# EAGLE schematic E73-2G4M04S1B_eink (EAGLE 6.1)

## Sheet 1 of 2
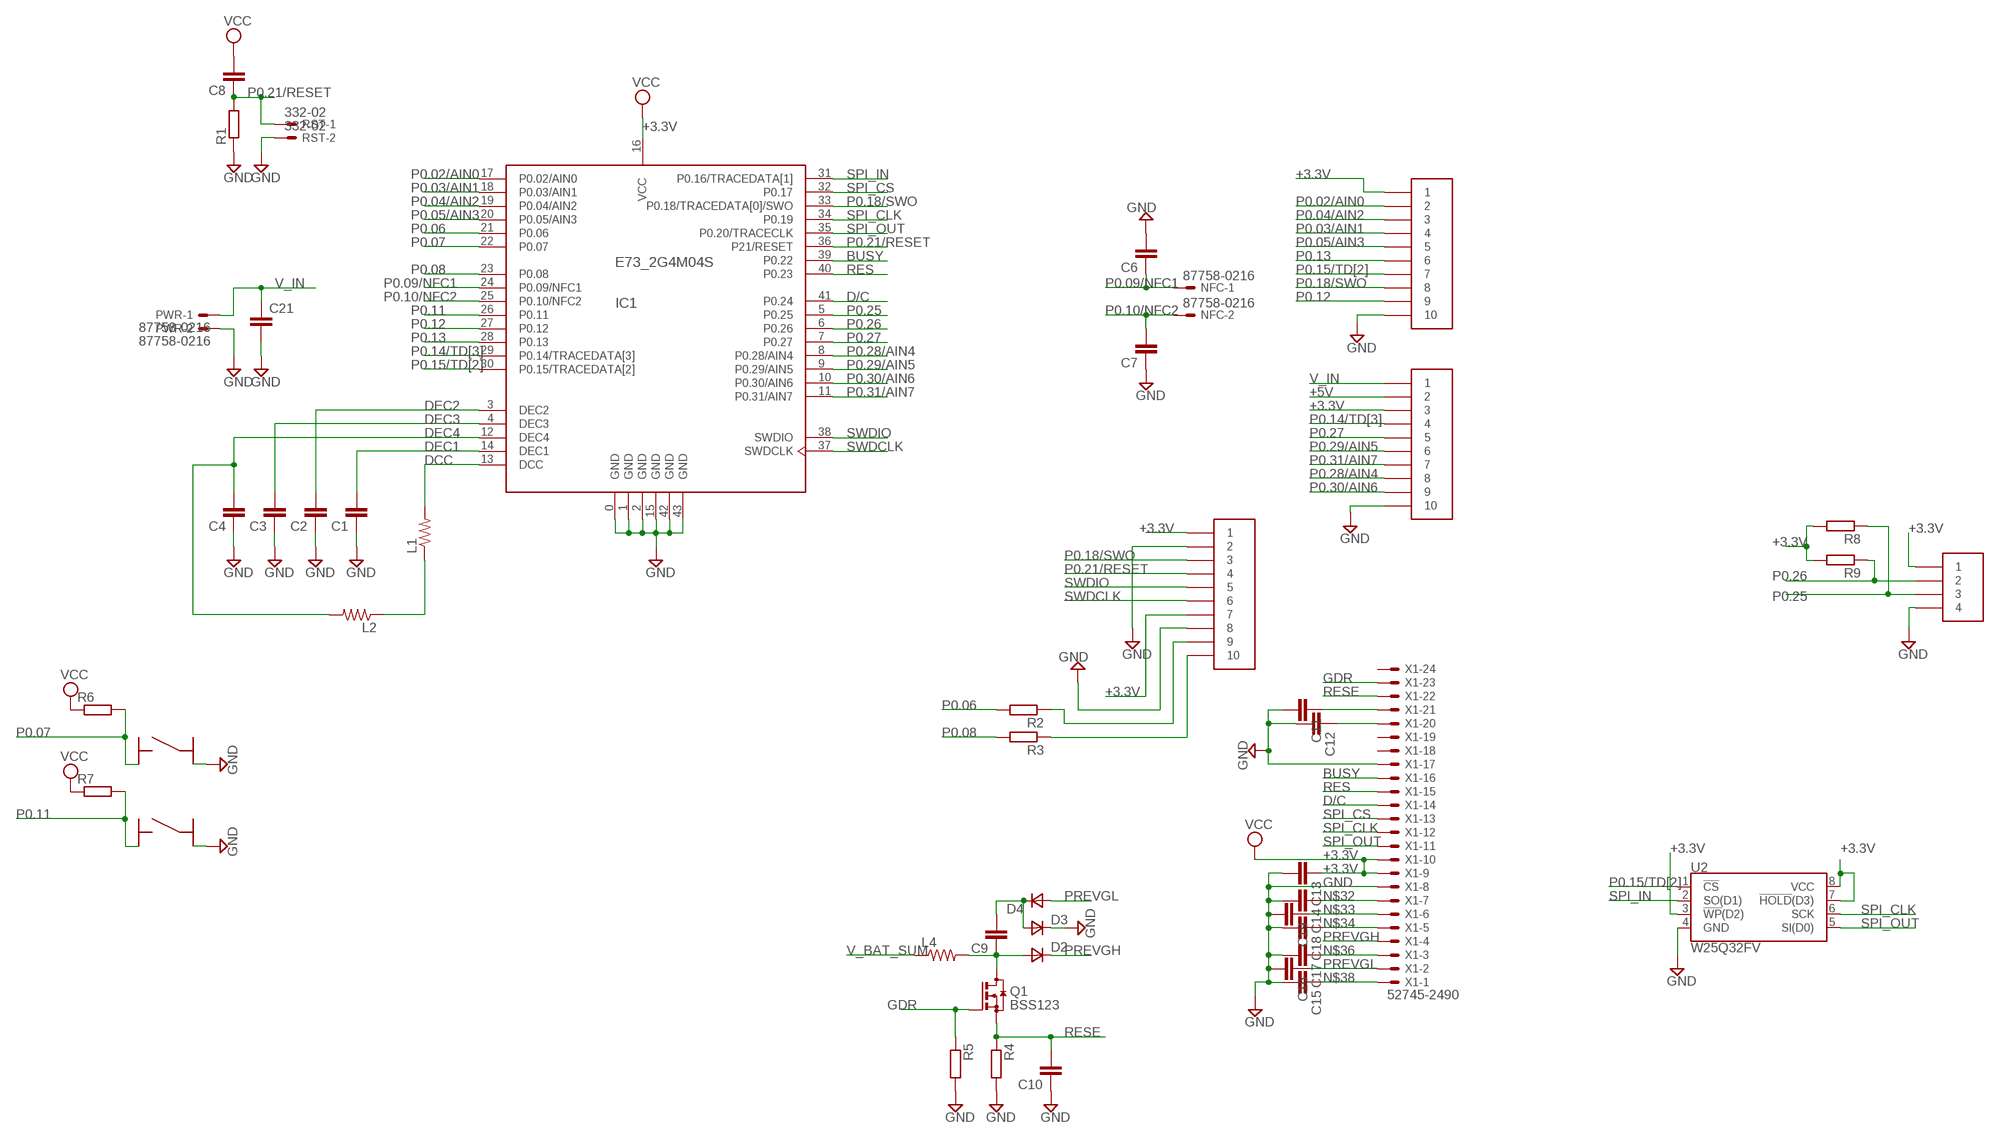
[diagram p0: schematic, sheet 1]

### Parts
C1  C-EUC0603  [C0603]
C2  C-EUC0603  [C0603]
C3  C-EUC0603  [C0603]
C4  C-EUC0603  [C0603]
C6  C-EUC0603  [C0603]
C7  C-EUC0603  [C0603]
C8  C-EUC0603  [C0603]
C9  C-EUC0603  [C0603]
C10  C-EUC0603  [C0603]
C11  C-EUC0603  [C0603]
C12  C-EUC0603  [C0603]
C13  C-EUC0603  [C0603]
C14  C-EUC0603  [C0603]
C15  C-EUC0603  [C0603]
C16  C-EUC0603  [C0603]
C17  C-EUC0603  [C0603]
C18  C-EUC0603  [C0603]
C19  C-EUC0603  [C0603]
C21  C-EUC0805  [C0805]
D2  DSOD323  [SOD323]
D3  DSOD323  [SOD323]
D4  DSOD323  [SOD323]
DBG-COM  HDR-1.27MM-110  [HDR-1.27MM-1*10]
DBG-COM1  HDR-1.27MM-110  [HDR-1.27MM-1*10]
DBG-COM2  HDR-1.27MM-110  [HDR-1.27MM-1*10]
IC1  E73_2G4M04S  [E73_2G4M04S]
L1  R-US_R0805  [R0805]
L2  R-US_R0805  [R0805]
L4  R-US_R0805  [R0805]
NFC  87758-0216  [87758-0216]
PWR  87758-0216  [87758-0216]
Q1  BSS123  [SOT23]
R1  R-EU_R0603  [R0603]
R2  R-EU_R0603  [R0603]
R3  R-EU_R0603  [R0603]
R4  R-EU_R0603  [R0603]
R5  R-EU_R0603  [R0603]
R6  R-EU_R0603  [R0603]
R7  R-EU_R0603  [R0603]
R8  R-EU_R0603  [R0603]
R9  R-EU_R0603  [R0603]
RST  332-02  [332-02]
U2  W25Q32FV  W25Q32FVSS  [SOIC-8]
U$3  HDR-1.27MM-14  [HDR-1.27MM-1*4]
U$4  BUTTON_3X3MM_4PINS  [BUT_3X3_4PINS]
U$5  BUTTON_3X3MM_4PINS  [BUT_3X3_4PINS]
X1  52745-2490  [52745-2490]

### Nets
+3.3V: C8.2 C13.1 DBG-COM1.P$1 DBG-COM2.P$3 DBG-COM.P$1 DBG-COM.P$7 IC1.16(VCC) R6.1 R7.1 R8.2 R9.2 U2.3(!WP!(D2)) U2.7(!HOLD!(D3)) U2.8(VCC) U$3.P$1 X1.9 X1.10 ; supply symbol labelled VCC ; also sheet 2
+5V: DBG-COM2.P$2 ; also sheet 2
BUSY: IC1.39(P0.22) X1.16
D/C: IC1.41(P0.24) X1.14
DCC: IC1.13(DCC) L1.2
DEC1: C1.2 IC1.14(DEC1)
DEC2: C2.2 IC1.3(DEC2)
DEC3: C3.2 IC1.4(DEC3)
DEC4: C4.2 IC1.12(DEC4) L2.2
GDR: Q1.1(G) R5.1 X1.23
GND: C1.1 C2.1 C3.1 C4.1 C6.2 C7.1 C10.1 C11.2 C12.2 C13.2 C14.2 C15.2 C16.2 C17.2 C18.2 C19.2 C21.2 D3.1(C) DBG-COM1.P$10 DBG-COM2.P$10 DBG-COM.P$2 DBG-COM.P$8 IC1.0(GND) IC1.1(GND) IC1.2(GND) IC1.15(GND) IC1.42(GND) IC1.43(GND) PWR.2 R1.1 R4.2 R5.2 RST.2 U2.4(GND) U$3.P$4 U$4.P$2 U$5.P$2 X1.8 X1.17 ; also sheet 2
N$1: DBG-COM.P$10 R3.1
N$2: L1.1 L2.1
N$4: DBG-COM.P$9 R2.1
N$6: C9.1 D2.2(A) L4.2 Q1.3(D)
N$7: C9.2 D3.2(A) D4.1(C)
N$17: C11.1 X1.21
N$18: C12.1 X1.20
N$32: C14.1 X1.7
N$33: C19.1 X1.6
N$34: C18.1 X1.5
N$36: C17.1 X1.3
N$38: C15.1 X1.1
P0.02/AIN0: DBG-COM1.P$2 IC1.17(P0.02/AIN0)
P0.03/AIN1: DBG-COM1.P$4 IC1.18(P0.03/AIN1)
P0.04/AIN2: DBG-COM1.P$3 IC1.19(P0.04/AIN2)
P0.05/AIN3: DBG-COM1.P$5 IC1.20(P0.05/AIN3)
P0.06: IC1.21(P0.06) R2.2
P0.07: IC1.22(P0.07) R6.2 U$4.P$1
P0.08: IC1.23(P0.08) R3.2
P0.09/NFC1: C6.1 IC1.24(P0.09/NFC1) NFC.1
P0.10/NFC2: C7.2 IC1.25(P0.10/NFC2) NFC.2
P0.11: IC1.26(P0.11) R7.2 U$5.P$1
P0.12: DBG-COM1.P$9 IC1.27(P0.12)
P0.13: DBG-COM1.P$6 IC1.28(P0.13)
P0.14/TD[3]: DBG-COM2.P$4 IC1.29(P0.14/TRACEDATA[3])
P0.15/TD[2]: DBG-COM1.P$7 IC1.30(P0.15/TRACEDATA[2]) U2.1(!CS!)
P0.18/SWO: DBG-COM1.P$8 DBG-COM.P$3 IC1.33(P0.18/TRACEDATA[0]/SWO)
P0.21/RESET: C8.1 DBG-COM.P$4 IC1.36(P21/RESET) R1.2 RST.1
P0.25: IC1.5(P0.25) R8.1 U$3.P$3
P0.26: IC1.6(P0.26) R9.1 U$3.P$2
P0.27: DBG-COM2.P$5 IC1.7(P0.27)
P0.28/AIN4: DBG-COM2.P$8 IC1.8(P0.28/AIN4)
P0.29/AIN5: DBG-COM2.P$6 IC1.9(P0.29/AIN5)
P0.30/AIN6: DBG-COM2.P$9 IC1.10(P0.30/AIN6)
P0.31/AIN7: DBG-COM2.P$7 IC1.11(P0.31/AIN7)
PREVGH: D2.1(C) X1.4
PREVGL: C16.1 D4.2(A) X1.2
RES: IC1.40(P0.23) X1.15
RESE: C10.2 Q1.2(S) R4.1 X1.22
SPI_CLK: IC1.34(P0.19) U2.6(SCK) X1.12
SPI_CS: IC1.32(P0.17) X1.13
SPI_IN: IC1.31(P0.16/TRACEDATA[1]) U2.2(SO(D1))
SPI_OUT: IC1.35(P0.20/TRACECLK) U2.5(SI(D0)) X1.11
SWDCLK: DBG-COM.P$6 IC1.37(SWDCLK)
SWDIO: DBG-COM.P$5 IC1.38(SWDIO)
V_BAT_SUM: L4.1 ; also sheet 2
V_IN: C21.1 DBG-COM2.P$1 PWR.1 ; also sheet 2
Unconnected: U$4.P$3 U$4.P$4 U$5.P$3 U$5.P$4 X1.18 X1.19 X1.24

## Sheet 2 of 2
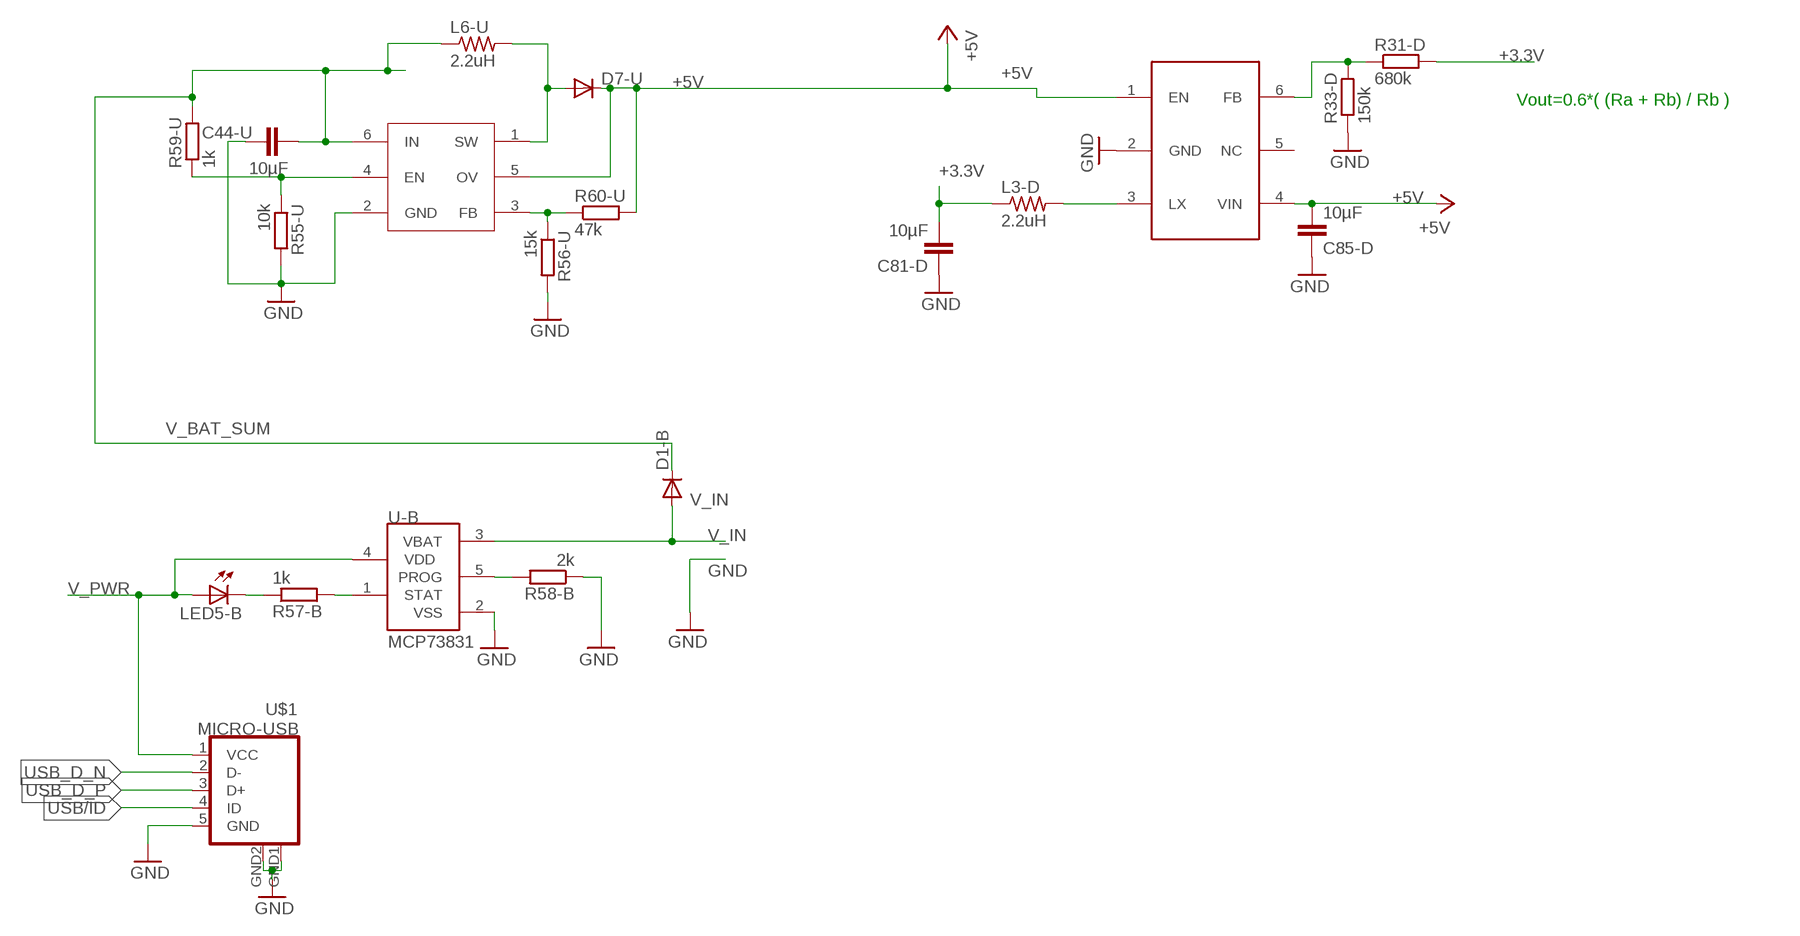
[diagram p1: schematic, sheet 2]

### Parts
C44-U  10µF  C-EUC0805  [C0805]
C81-D  10µF  C-EUC0805  [C0805]
C85-D  10µF  C-EUC0805  [C0805]
D1-B  DIODE-SOD323-W  [SOD323-W]
D7-U  DIODE-SOD323-W  [SOD323-W]
L3-D  2.2uH  R-US_R0805  [R0805]
L6-U  2.2uH  R-US_R0805  [R0805]
LED5-B  LEDCHIPLED_0805  [CHIPLED_0805]
R31-D  680k  R-EU_R0603  [R0603]
R33-D  150k  R-EU_R0603  [R0603]
R55-U  10k  R-EU_R0603  [R0603]
R56-U  15k  R-EU_R0603  [R0603]
R57-B  1k  R-EU_R0603  [R0603]
R58-B  2k  R-EU_R0603  [R0603]
R59-U  1k  R-EU_R0603  [R0603]
R60-U  47k  R-EU_R0603  [R0603]
U$1  MICRO-USB  [MICRO-USB]
U-B  MCP73831  [SOT23-5L]
U-D  STI3411  [SOT23-6]
U-U  PT4101  [SOT23-6]

### Nets
+3.3V: C81-D.2 L3-D.1 R31-D.2 ; also sheet 1
+5V: C85-D.2 D7-U.C R60-U.2 U-D.1(EN) U-D.4(VIN) U-U.5(OV) ; also sheet 1
GND: C44-U.2 C81-D.1 C85-D.1 R33-D.1 R55-U.2 R56-U.2 R58-B.1 U$1.5(GND) U$1.GND1(GND) U$1.GND2(GND) U-B.2(VSS) U-D.2(GND) U-U.2(GND) ; also sheet 1
N$10: R56-U.1 R60-U.1 U-U.3(FB)
N$12: R55-U.1 R59-U.1 U-U.4(EN)
N$13: D7-U.A L6-U.2 U-U.1(SW)
N$16: L3-D.2 U-D.3(LX)
N$31: R31-D.1 R33-D.2 U-D.6(FB)
N$46: R58-B.2 U-B.5(PROG)
N$50: R57-B.2 U-B.1(STAT)
N$51: LED5-B.C R57-B.1
USB/ID: U$1.4(ID)
USB_D_N: U$1.2(D-)
USB_D_P: U$1.3(D+)
V_BAT_SUM: C44-U.1 D1-B.C L6-U.1 R59-U.2 U-U.6(IN) ; also sheet 1
V_IN: D1-B.A U-B.3(VBAT) ; also sheet 1
V_PWR: LED5-B.A U$1.1(VCC) U-B.4(VDD)
Unconnected: U-D.5(NC)

### Notes on the sheet
- Vout=0.6*( (Ra + Rb) / Rb )

## Library data of the parts
C1-C4 C6-C19 C21 C44-U = rcl:C-EU: CAPACITOR, European symbol
C81-D C85-D = rcl@1:C-EU: CAPACITOR, European symbol; SPICEPREFIX: C
D1-B D7-U = diode:DIODE-: DIODE
D2-D4 = zetex:D: DIODE; MPN: CDSOD323-T05C; OC_FARNELL: 1824860; OC_NEWARK: 79R6078
DBG-COM DBG-COM1 DBG-COM2 = headers-1.27:HDR-1.27MM-1*10
IC1 = E73-2G4M04S:E73_2G4M04S: E73-2G4M04S nRF52832 based BLE module
L1 L2 L3-D L4 L6-U = resistor:R-US_: RESISTOR, American symbol
LED5-B = led:LED: LED OSRAM: - CHIPLED LG R971, LG N971, LY N971, LG Q971, LY Q971, LO R971, LY R971 LH N974, LH R974 LS Q976, LO Q976, LY Q976 LO Q996 - Hyper CHIPLED LW Q18S LB Q993, LB Q99A, LB R99A - SideLED LS A670, LO A670, LY A670, LG A670, LP A670 LB A673, LV A673, LT A673, LW A673 LH A674 LY A675 LS A676, LA A676, LO A676, LY A676, LW A676 LS A679, LY A679, LG A679 - Hyper Micro SIDELED® LS Y876, LA Y876, LO Y876, LY Y876 LT Y87S - SmartLED LW L88C, LW L88S LB L89C, LB L89S, LG L890 LS L89K, LO L89K, LY L89K LS L896, LA L896, LO L896, LY L896 - TOPLED LS T670, LO T670, LY T670, LG T670, LP T670 LSG T670, LSP T670, LSY T670, LOP T670, LYG T670 LG T671, LOG T671, LSG T671 LB T673, LV T673, LT T673, LW T673 LH T674 LS T676, LA T676, LO T676, LY T676, LB T676, LH T676, LSB T676, LW T676 LB T67C, LV T67C, LT T67C, LS T67K, LO T67K, LY T67K, LW E67C LS E67B, LA E67B, LO E67B, LY E67B, LB E67C, LV E67C, LT E67C LW T67C LS T679, LY T679, LG T679 LS T770, LO T770, LY T770, LG T770, LP T770 LB T773, LV T773, LT T773, LW T773 LH T774 LS E675, LA E675, LY E675, LS T675 LS T776, LA T776, LO T776, LY T776, LB T776 LHGB T686 LT T68C, LB T68C - Hyper Mini TOPLED® LB M676 - Mini TOPLED Santana® LG M470 LS M47K, LO M47K, LY M47K Source: http://www.osram.convergy.de LUXEON: - LUMILED® LXK2-PW12-R00, LXK2-PW12-S00, LXK2-PW14-U00, LXK2-PW14-V00 LXK2-PM12-R00, LXK2-PM12-S00, LXK2-PM14-U00 LXK2-PE12-Q00, LXK2-PE12-R00, LXK2-PE12-S00, LXK2-PE14-T00, LXK2-PE14-U00 LXK2-PB12-K00, LXK2-PB12-L00, LXK2-PB12-M00, LXK2-PB14-N00, LXK2-PB14-P00, LXK2-PB14-Q00 LXK2-PR12-L00, LXK2-PR12-M00, LXK2-PR14-Q00, LXK2-PR14-R00 LXK2-PD12-Q00, LXK2-PD12-R00, LXK2-PD12-S00 LXK2-PH12-R00, LXK2-PH12-S00 LXK2-PL12-P00, LXK2-PL12-Q00, LXK2-PL12-R00 Source: www.luxeon.com KINGBRIGHT: KA-3528ASYC Source: www.kingbright.com
NFC PWR = con-molex:87758-0216: 2 Pin - 2mm Dual Row Single Wafer, Vertical T/H HDR Source: http://www.molex.com/pdm_docs/sd/877580616_sd.pdf; MPN: 87758-0216; OC_FARNELL: unknown; OC_NEWARK: 94M1513
Q1 = transistor-small-signal:BSS123: N-CHANNEL MOS FET
R1-R9 R31-D R33-D R55-U R56-U R57-B R58-B R59-U R60-U = rcl:R-EU_: RESISTOR, European symbol
RST = con-garry:332-02: 2 Pin - 2mm Dual Row Source: www.mpe-connector.de / garry_shortform_2012.pdf
U2 = SparkFun-IC-Memory:W25Q32FV: W25Q32FV 32Mb (4MB) Serial Flash Memory The W25Q32FV support the standard Serial Peripheral Interface (SPI), Dual/Quad I/O SPI as well as 2-clocks instruction cycle Quad Peripheral Interface (QPI). 104MHz, SPI, 8-SOIC-EIAJ Datasheet <http://www.winbond.com/resource-files/w25q32fv%20revh%20091613.pdf> SparkFun Products SparkFun Blynk Board - ESP8266 <https://www.sparkfun.com/products/13794> (WRL-13794); PROD_ID: IC-13229
U$1 = microusb:MICRO-USB: Micro USB B connector
U$3 = headers-1.27:HDR-1.27MM-1*4
U$4 U$5 = my_but:BUTTON_3X3MM_4PINS
U-B = mcp73831:MCP73831: Miniature Single-Cell, Fully Integrated Li-Ion, Li-Polymer Charge Management Controllers
U-D = dcdc:STI3411
U-U = PT4101:PT4101
X1 = con-molex:52745-2490: FFC/FPC-to-Board 0.50mm (.020") SMT Top Contact Right Angle, ZIF, Style Receptacle 52745 / 52435 Source: http://www.molex.com/product/ffc/52745.html; OC_FARNELL: unknown; OC_NEWARK: unknown